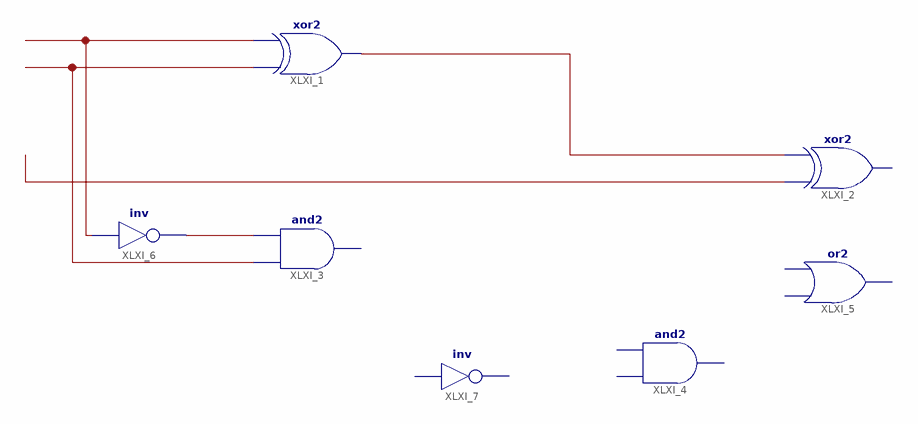
[diagram p0: schematic sheet 1]
// Xilinx ISE schematic schemacio.sch (spartan3e) as structural Verilog: 7 symbols, 0 ports
module schemacio (
);

  wire XLXN_3, XLXN_5, XLXN_6, XLXN_7, XLXN_8;

  xor XLXI_1 (XLXN_7, XLXN_5, XLXN_3);
  // xor2 XLXI_2 has open pins: I0=XLXN_8, I1=XLXN_7, O=open
  // and2 XLXI_3 has open pins: I0=XLXN_5, I1=XLXN_6, O=open
  // and2 XLXI_4 is placed but not wired
  // or2 XLXI_5 is placed but not wired
  not XLXI_6 (XLXN_6, XLXN_3);
  // inv XLXI_7 is placed but not wired
endmodule
